# EAGLE schematic programmable-xtal-breakout (EAGLE 8.6.1)
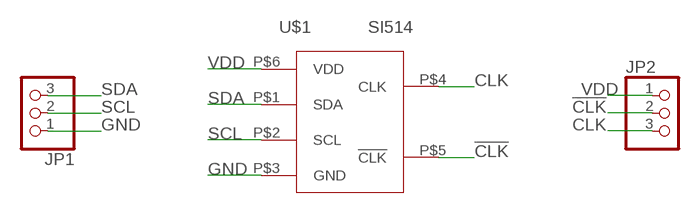
[diagram p0: schematic, sheet 1]

## Parts
JP1  PINHD-1X3  [1X03]
JP2  PINHD-1X3  [1X03]
U$1  SI514  [XTAL-6PIN]

## Nets
!CLK: JP2.2 U$1.P$5(!CLK)
CLK: JP2.3 U$1.P$4(CLK)
GND: JP1.1 U$1.P$3(GND)
SCL: JP1.2 U$1.P$2(SCL)
SDA: JP1.3 U$1.P$1(SDA)
VDD: JP2.1 U$1.P$6(VDD)

## Library data of the parts
JP1 JP2 = pinhead:PINHD-1X3: PIN HEADER
U$1 = lupa300-components:SI514